# Altium schematic sheet Ethernet.SchDoc
size A0; SheetNumber: 4; SheetTotal: 12
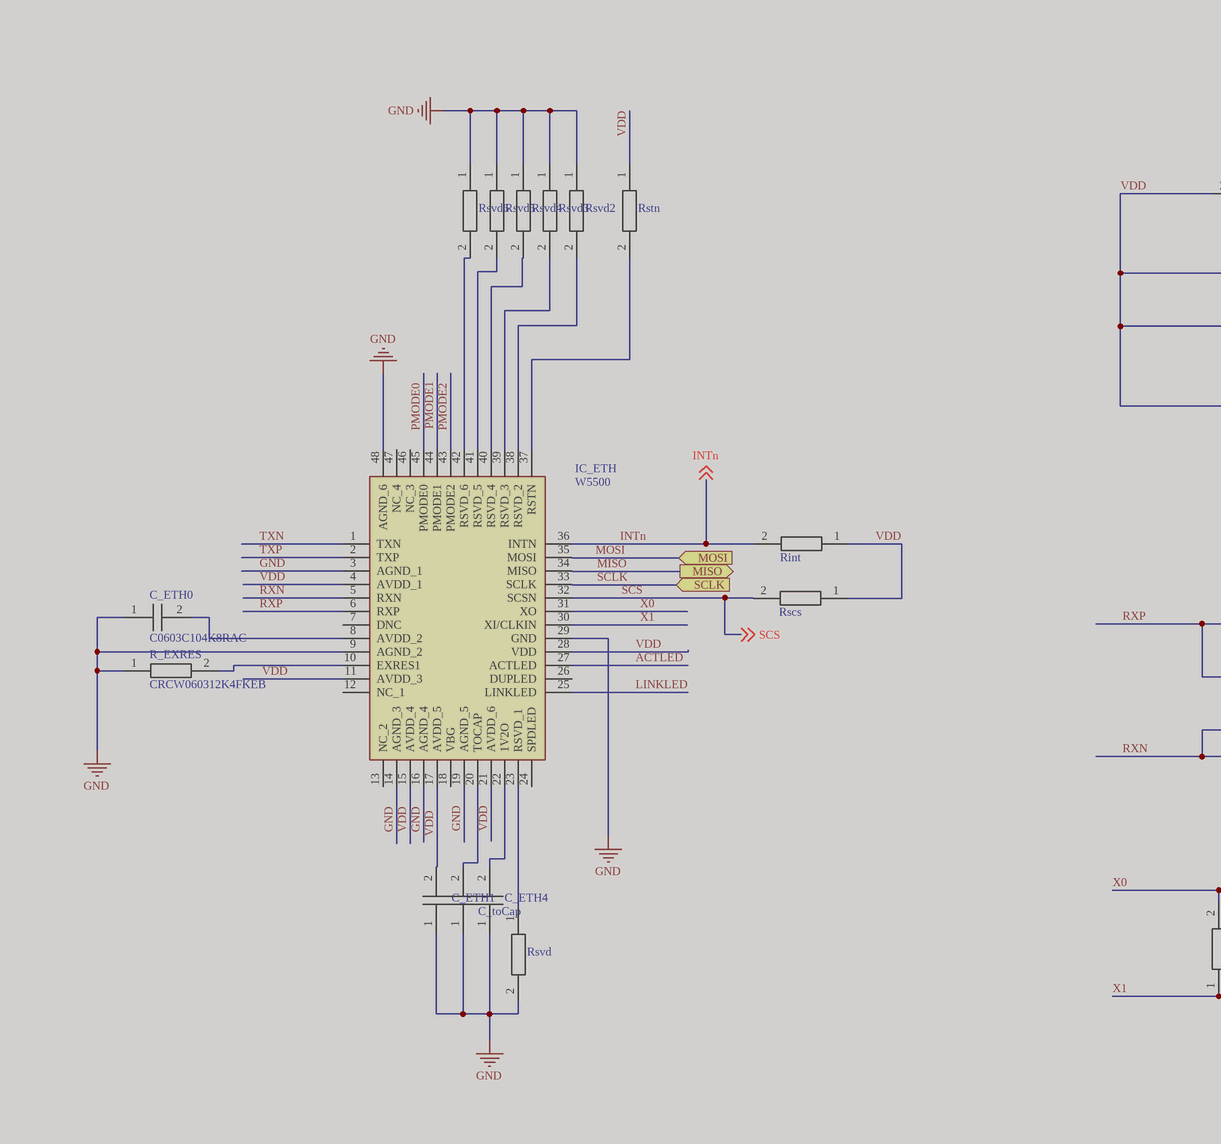
[diagram p0: Ethernet.SchDoc, left]
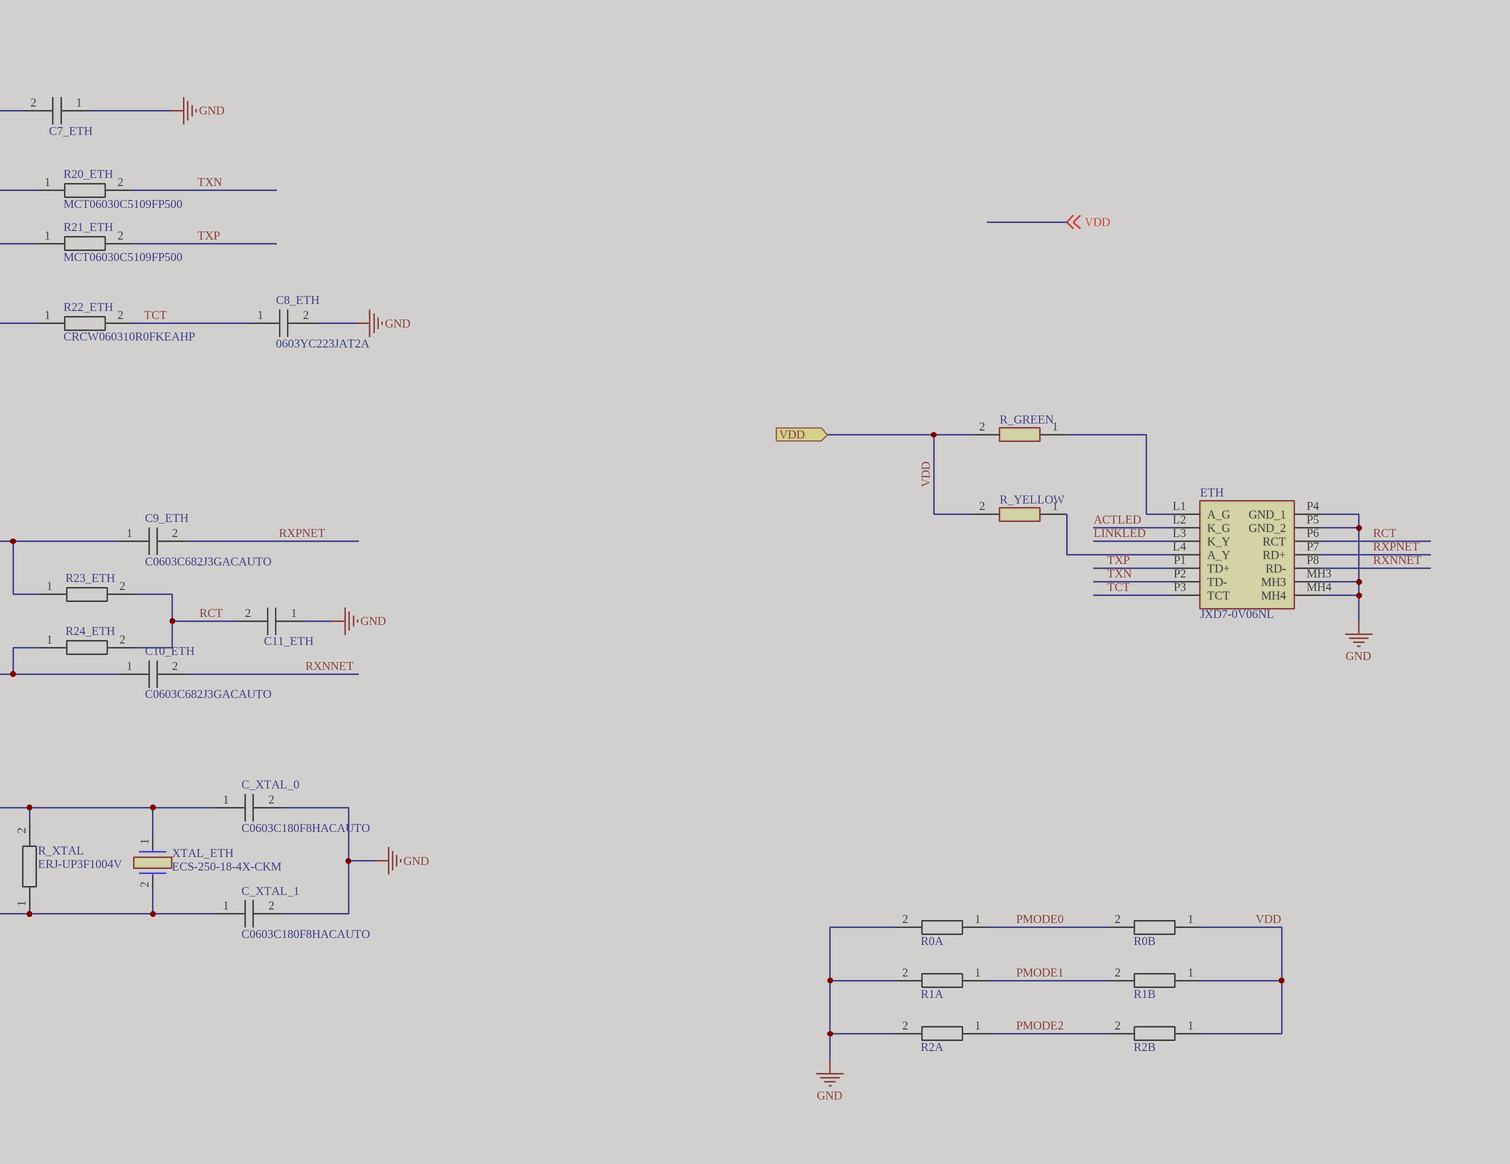
[diagram p1: Ethernet.SchDoc, right]

## Parts
C7_ETH  C0603C104K8RAC  [CAPC1608X95N]  (value not drawn)  (masked out: inside a compile mask, not in the netlist)
C8_ETH  0603YC223JAT2A  [CAPC1608X90N]  (masked out: inside a compile mask, not in the netlist)
C9_ETH  C0603C682J3GACAUTO  [C0603]  (masked out: inside a compile mask, not in the netlist)
C10_ETH  C0603C682J3GACAUTO  [C0603]  (masked out: inside a compile mask, not in the netlist)
C11_ETH  CGA3E2C0G1H103J080AA  [CAPC1608X90N]  (value not drawn)  (masked out: inside a compile mask, not in the netlist)
C_ETH0  C0603C104K8RAC  [CAPC1608X95N]  (masked out: inside a compile mask, not in the netlist)
C_ETH1  C0603C104K8RAC  [CAPC1608X95N]  (value not drawn)  (masked out: inside a compile mask, not in the netlist)
C_ETH4  CGA3E2C0G1H103J080AA  [CAPC1608X90N]  (value not drawn)  (masked out: inside a compile mask, not in the netlist)
C_toCap  GRM188Z71C475KE21D  [CAPC1608X90N]  (value not drawn)  (masked out: inside a compile mask, not in the netlist)
C_XTAL_0  C0603C180F8HACAUTO  [C0603]  (masked out: inside a compile mask, not in the netlist)
C_XTAL_1  C0603C180F8HACAUTO  [C0603]  (masked out: inside a compile mask, not in the netlist)
ETH  JXD7-0V06NL  [JXD70V06NL]  (masked out: inside a compile mask, not in the netlist)
IC_ETH  W5500  [QFP50P900X900X160-48N]  (masked out: inside a compile mask, not in the netlist)
R0A  CRCW060310K0FKEB  [RESC1608X50N]  (value not drawn)  (masked out: inside a compile mask, not in the netlist)
R0B  CRCW060310K0FKEB  [RESC1608X50N]  (value not drawn)  (masked out: inside a compile mask, not in the netlist)
R1A  CRCW060310K0FKEB  [RESC1608X50N]  (value not drawn)  (masked out: inside a compile mask, not in the netlist)
R1B  CRCW060310K0FKEB  [RESC1608X50N]  (value not drawn)  (masked out: inside a compile mask, not in the netlist)
R2A  CRCW060310K0FKEB  [RESC1608X50N]  (value not drawn)  (masked out: inside a compile mask, not in the netlist)
R2B  CRCW060310K0FKEB  [RESC1608X50N]  (value not drawn)  (masked out: inside a compile mask, not in the netlist)
R20_ETH  MCT06030C5109FP500  [RESC1608X55N]  (masked out: inside a compile mask, not in the netlist)
R21_ETH  MCT06030C5109FP500  [RESC1608X55N]  (masked out: inside a compile mask, not in the netlist)
R22_ETH  CRCW060310R0FKEAHP  [RESC1608X50N]  (masked out: inside a compile mask, not in the netlist)
R23_ETH  CRCW060382R0FKEA  [RESC1608X50N]  (value not drawn)  (masked out: inside a compile mask, not in the netlist)
R24_ETH  CRCW060382R0FKEA  [RESC1608X50N]  (value not drawn)  (masked out: inside a compile mask, not in the netlist)
R_EXRES  CRCW060312K4FKEB  [RESC1608X50N]  (masked out: inside a compile mask, not in the netlist)
R_GREEN  RN73H1JTTD1002F50  [RESC1608X55N]  (value not drawn)  (masked out: inside a compile mask, not in the netlist)
R_XTAL  ERJ-UP3F1004V  [ERJUP3]  (masked out: inside a compile mask, not in the netlist)
R_YELLOW  RN73H1JTTD1002F50  [RESC1608X55N]  (value not drawn)  (masked out: inside a compile mask, not in the netlist)
Rint  CRCW060310K0FKEB  [RESC1608X50N]  (value not drawn)  (masked out: inside a compile mask, not in the netlist)
Rscs  CRCW060310K0FKEB  [RESC1608X50N]  (value not drawn)  (masked out: inside a compile mask, not in the netlist)
Rstn  CRCW060310K0FKEB  [RESC1608X50N]  (value not drawn)  (masked out: inside a compile mask, not in the netlist)
Rsvd  CRCW060310K0FKEB  [RESC1608X50N]  (value not drawn)  (masked out: inside a compile mask, not in the netlist)
Rsvd2  CRCW060310K0FKEB  [RESC1608X50N]  (value not drawn)  (masked out: inside a compile mask, not in the netlist)
Rsvd3  CRCW060310K0FKEB  [RESC1608X50N]  (value not drawn)  (masked out: inside a compile mask, not in the netlist)
Rsvd4  CRCW060310K0FKEB  [RESC1608X50N]  (value not drawn)  (masked out: inside a compile mask, not in the netlist)
Rsvd5  CRCW060310K0FKEB  [RESC1608X50N]  (value not drawn)  (masked out: inside a compile mask, not in the netlist)
Rsvd6  CRCW060310K0FKEB  [RESC1608X50N]  (value not drawn)  (masked out: inside a compile mask, not in the netlist)
XTAL_ETH  ECS-250-18-4X-CKM  [ECS250184XCKM]  (masked out: inside a compile mask, not in the netlist)

## Ports
MISO (out), MOSI (in), SCLK (in), VDD (in)

## Library data of the parts
C7_ETH C_ETH0 C_ETH1 = C0603C104K8RAC: Capacitor; Manufacturer_Name: KEMET; Datasheet Link: https://www.kemet.com/specsheet/C0603C104K8RAC%7BBULK%7D; Height: 0.95mm; Manufacturer_Part_Number: C0603C104K8RAC; Mouser Part Number: 80-C0603C104K8RAC; Mouser Price/Stock: https://www.mouser.co.uk/ProductDetail/KEMET/C0603C104K8RAC?qs=JxH5GSBHSCStdUs4AtW0Gg%3D%3D; Arrow Part Number: C0603C104K8RAC; Arrow Price/Stock: https://www.arrow.com/en/products/c0603c104k8rac/kemet-corporation?region=nac
C8_ETH = 0603YC223JAT2A: Capacitor; Manufacturer_Name: AVX; Datasheet Link: https://componentsearchengine.com/Datasheets/1/06031A100FAT2A.pdf; Height: 0.9mm; Manufacturer_Part_Number: 0603YC223JAT2A; Mouser Part Number: 581-0603YC223JAT2A; Mouser Price/Stock: https://www.mouser.com/Search/Refine.aspx?Keyword=581-0603YC223JAT2A; Arrow Part Number: 0603YC223JAT2A; Arrow Price/Stock: https://www.arrow.com/en/products/0603yc223jat2a/avx
C9_ETH C10_ETH = C0603C682J3GACAUTO: Capacitor; Manufacturer_Name: KEMET; Datasheet Link: https://content.kemet.com/datasheets/KEM_C1022_C0G_AUTO_SMD.pdf; Height: 0.87mm; Manufacturer_Part_Number: C0603C682J3GACAUTO; Mouser Part Number: 80-C0603C682J3GAUTO; Mouser Price/Stock: https://www.mouser.co.uk/ProductDetail/KEMET/C0603C682J3GACAUTO?qs=hzBznG4dWXWbYOO7wTvwnw%3D%3D
C11_ETH C_ETH4 = CGA3E2C0G1H103J080AA: Capacitor; Manufacturer_Name: TDK; Datasheet Link: https://product.tdk.com/system/files/dam/doc/product/capacitor/ceramic/mlcc/catalog/mlcc_automotive_general_en.pdf; Height: 0.9mm; Manufacturer_Part_Number: CGA3E2C0G1H103J080AA; Mouser Part Number: 810-CGA3E2C0G1H103J; Mouser Price/Stock: https://www.mouser.co.uk/ProductDetail/TDK/CGA3E2C0G1H103J080AA?qs=FxQuwy19cyDZbtgsz1Zj3w%3D%3D; Arrow Part Number: CGA3E2C0G1H103J080AA; Arrow Price/Stock: https://www.arrow.com/en/products/cga3e2c0g1h103j080aa/tdk
C_toCap = GRM188Z71C475KE21D: Capacitor; Manufacturer_Name: Murata Electronics; Height: 0.9mm; Manufacturer_Part_Number: GRM188Z71C475KE21D; Mouser Part Number: 81-GRM188Z71C475KE1D; Mouser Price/Stock: https://www.mouser.co.uk/ProductDetail/Murata-Electronics/GRM188Z71C475KE21D?qs=d0WKAl%252BL4KajNOvalhHKtQ%3D%3D; Arrow Part Number: GRM188Z71C475KE21D; Arrow Price/Stock: https://www.arrow.com/en/products/grm188z71c475ke21d/murata-manufacturing?region=europe
C_XTAL_0 C_XTAL_1 = C0603C180F8HACAUTO: Capacitor; Manufacturer_Name: KEMET; Datasheet Link: https://content.kemet.com/datasheets/KEM_C1007_X8R_ULTRA_150C_SMD.pdf; Height: 0.87mm; Manufacturer_Part_Number: C0603C180F8HACAUTO; Mouser Part Number: 80-C0603C180F8HAUTO; Mouser Price/Stock: https://www.mouser.co.uk/ProductDetail/KEMET/C0603C180F8HACAUTO?qs=j%252B1pi9TdxUYBmkMIwopXuQ%3D%3D
ETH = JXD7-0V06NL: Connector; Manufacturer_Name: Pulse Electronics; Datasheet Link: https://productfinder.pulseelectronics.com/api/open/product-attachments/datasheet/jxd7-0v06nl; Height: 13.75mm; Manufacturer_Part_Number: JXD7-0V06NL; Mouser Part Number: 673-JXD7-0V06NL; Mouser Price/Stock: https://www.mouser.co.uk/ProductDetail/Pulse-Electronics/JXD7-0V06NL?qs=tlsG%2FOw5FFh4BJdtxVEWnw%3D%3D
IC_ETH = W5500: Integrated Circuit; Manufacturer_Name: WIZnet Inc; Datasheet Link: http://wizwiki.net/wiki/lib/exe/fetch.php?media=products:w5500:w5500_ds_v106e_141230.pdf; Height: 1.6mm; Manufacturer_Part_Number: W5500; Mouser Part Number: 950-W5500; Mouser Price/Stock: https://www.mouser.co.uk/ProductDetail/WIZnet/W5500?qs=2vh%252B45pPFtzthUpYPd4pqA%3D%3D
R0A R0B R1A R1B R2A R2B Rint Rscs Rstn Rsvd Rsvd2-Rsvd6 = CRCW060310K0FKEB: Resistor; Manufacturer_Name: Vishay; Datasheet Link: http://www.vishay.com/docs/20035/dcrcwe3.pdf; Height: 0.5mm; Manufacturer_Part_Number: CRCW060310K0FKEB; Mouser Part Number: 71-CRCW060310K0FKEB; Mouser Price/Stock: https://www.mouser.co.uk/ProductDetail/Vishay-Dale/CRCW060310K0FKEB?qs=KP%252BPudsHLdyVfHu6lav4Iw%3D%3D; Arrow Part Number: CRCW060310K0FKEB; Arrow Price/Stock: https://www.arrow.com/en/products/crcw060310k0fkeb/vishay
R20_ETH R21_ETH = MCT06030C5109FP500: Resistor; Manufacturer_Name: Vishay; Datasheet Link: http://www.vishay.com/docs/28705/mcx0x0xpro.pdf; Height: 0.55mm; Manufacturer_Part_Number: MCT06030C5109FP500; Mouser Part Number: 594-MCT06030C5109FP5; Mouser Price/Stock: https://www.mouser.co.uk/ProductDetail/Vishay-Beyschlag/MCT06030C5109FP500?qs=hjSuqQECij8uzjowOg4JiA%3D%3D; Arrow Part Number: MCT06030C5109FP500; Arrow Price/Stock: https://www.arrow.com/en/products/mct06030c5109fp500/vishay?region=nac
R22_ETH = CRCW060310R0FKEAHP: Resistor; Manufacturer_Name: Vishay; Datasheet Link: http://www.farnell.com/datasheets/1885357.pdf; Height: 0.5mm; Manufacturer_Part_Number: CRCW060310R0FKEAHP; Mouser Part Number: 71-CRCW060310R0FKEAH; Mouser Price/Stock: https://www.mouser.co.uk/ProductDetail/Vishay-Dale/CRCW060310R0FKEAHP?qs=k2%2FDWSARqgHKJ7AdmQKyZw%3D%3D; Arrow Part Number: CRCW060310R0FKEAHP; Arrow Price/Stock: https://www.arrow.com/en/products/crcw060310r0fkeahp/vishay?region=nac
R23_ETH R24_ETH = CRCW060382R0FKEA: Resistor; Manufacturer_Name: Vishay; Datasheet Link: http://www.vishay.com/docs/20035/dcrcwe3.pdf; Height: 0.5mm; Manufacturer_Part_Number: CRCW060382R0FKEA; Mouser Part Number: 71-CRCW0603-82-E3; Mouser Price/Stock: https://www.mouser.co.uk/ProductDetail/Vishay-Dale/CRCW060382R0FKEA?qs=5rGgbCH0pB18%252BT0VmwhFKg%3D%3D
R_EXRES = CRCW060312K4FKEB: Resistor; Manufacturer_Name: Vishay; Datasheet Link: http://www.vishay.com/docs/20035/dcrcwe3.pdf; Height: 0.5mm; Manufacturer_Part_Number: CRCW060312K4FKEB; Mouser Part Number: 71-CRCW060312K4FKEB; Mouser Price/Stock: https://www.mouser.co.uk/ProductDetail/Vishay-Dale/CRCW060312K4FKEB?qs=FjnTi%2FStZU%2F2feO3GcoFXQ%3D%3D
R_GREEN R_YELLOW = RN73H1JTTD1002F50: Resistor; Manufacturer_Name: KOA Speer; Datasheet Link: https://www.koaglobal.com/-/media/Files/KOA_Global/EN/product/commonpdf/rn73h.pdf; Height: 0.55mm; Manufacturer_Part_Number: RN73H1JTTD1002F50; Mouser Part Number: 660-RN73H1JTD1002F50; Mouser Price/Stock: https://www.mouser.co.uk/ProductDetail/KOA-Speer/RN73H1JTTD1002F50?qs=0hon8nwgHrYkULp4meknmQ%3D%3D
R_XTAL = ERJ-UP3F1004V: Resistor; Manufacturer_Name: Panasonic; Datasheet Link: https://industrial.panasonic.com/cdbs/www-data/pdf/RDP0000/AOA0000C337.pdf; Height: 0.55mm; Manufacturer_Part_Number: ERJ-UP3F1004V; Mouser Part Number: 667-ERJ-UP3F1004V; Mouser Price/Stock: https://www.mouser.co.uk/ProductDetail/Panasonic/ERJ-UP3F1004V?qs=GedFDFLaBXE3dX6ROfhlog%3D%3D; Arrow Part Number: ERJ-UP3F1004V; Arrow Price/Stock: https://www.arrow.com/en/products/erj-up3f1004v/panasonic?region=nac
XTAL_ETH = ECS-250-18-4X-CKM: Crystal or Oscillator; Manufacturer_Name: ECS; Datasheet Link: https://www.arrow.com/en/products/ecs-250-18-4x-ckm/ecs-international; Height: 3.5mm; Manufacturer_Part_Number: ECS-250-18-4X-CKM; Mouser Part Number: 520-ECS250-18-4X-CKM; Mouser Price/Stock: https://www.mouser.co.uk/ProductDetail/ECS/ECS-250-18-4X-CKM?qs=7MVldsJ5UaxHIC%2FWkVVFMA%3D%3D; Arrow Part Number: ECS-250-18-4X-CKM; Arrow Price/Stock: https://www.arrow.com/en/products/ecs-250-18-4x-ckm/ecs-international?region=nac